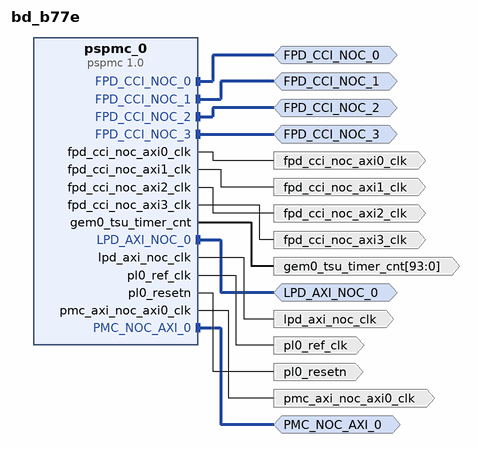
[diagram p0: block diagram of the top level]
# Vivado block design bd_b77e, xcvc1902-vsva2197-2MP-e-S, Vivado 2021.1
create_bd_design bd_b77e

create_bd_intf_port -mode Master -vlnv xilinx.com:interface:aximm_rtl:1.0 FPD_CCI_NOC_0
set_property -dict {CONFIG.FREQ_HZ 824999207 CONFIG.INDEX 0} [get_bd_intf_ports FPD_CCI_NOC_0]
create_bd_intf_port -mode Master -vlnv xilinx.com:interface:aximm_rtl:1.0 FPD_CCI_NOC_1
set_property -dict {CONFIG.FREQ_HZ 824999207 CONFIG.INDEX 1} [get_bd_intf_ports FPD_CCI_NOC_1]
create_bd_intf_port -mode Master -vlnv xilinx.com:interface:aximm_rtl:1.0 FPD_CCI_NOC_2
set_property -dict {CONFIG.FREQ_HZ 824999207 CONFIG.INDEX 2} [get_bd_intf_ports FPD_CCI_NOC_2]
create_bd_intf_port -mode Master -vlnv xilinx.com:interface:aximm_rtl:1.0 FPD_CCI_NOC_3
set_property -dict {CONFIG.FREQ_HZ 824999207 CONFIG.INDEX 3} [get_bd_intf_ports FPD_CCI_NOC_3]
create_bd_intf_port -mode Master -vlnv xilinx.com:interface:aximm_rtl:1.0 LPD_AXI_NOC_0
set_property -dict {CONFIG.FREQ_HZ 591666077 CONFIG.INDEX 0} [get_bd_intf_ports LPD_AXI_NOC_0]
create_bd_intf_port -mode Master -vlnv xilinx.com:interface:aximm_rtl:1.0 PMC_NOC_AXI_0
set_property -dict {CONFIG.FREQ_HZ 400000000 CONFIG.INDEX 0} [get_bd_intf_ports PMC_NOC_AXI_0]
create_bd_port -dir O -type clk pl0_ref_clk
set_property -dict {CONFIG.FREQ_HZ 333333008} [get_bd_ports pl0_ref_clk]
create_bd_port -dir O -type rst pl0_resetn
create_bd_port -dir O -type clk fpd_cci_noc_axi0_clk
set_property -dict {CONFIG.FREQ_HZ 824999207} [get_bd_ports fpd_cci_noc_axi0_clk]
create_bd_port -dir O -type clk fpd_cci_noc_axi1_clk
set_property -dict {CONFIG.FREQ_HZ 824999207} [get_bd_ports fpd_cci_noc_axi1_clk]
create_bd_port -dir O -type clk fpd_cci_noc_axi2_clk
set_property -dict {CONFIG.FREQ_HZ 824999207} [get_bd_ports fpd_cci_noc_axi2_clk]
create_bd_port -dir O -type clk fpd_cci_noc_axi3_clk
set_property -dict {CONFIG.FREQ_HZ 824999207} [get_bd_ports fpd_cci_noc_axi3_clk]
create_bd_port -dir O -type clk lpd_axi_noc_clk
set_property -dict {CONFIG.FREQ_HZ 591666077} [get_bd_ports lpd_axi_noc_clk]
create_bd_port -dir O -type clk pmc_axi_noc_axi0_clk
set_property -dict {CONFIG.FREQ_HZ 400000000} [get_bd_ports pmc_axi_noc_axi0_clk]
create_bd_port -dir O -from 93 -to 0 gem0_tsu_timer_cnt

create_bd_cell -type ip -vlnv xilinx.com:ip:pspmc:1.0 pspmc_0
set_property -dict [list \
  CONFIG.PMC_EXTERNAL_TAMPER {{{ENABLE 0} {IO None}}} \
  CONFIG.PMC_GPIO0_MIO_PERIPHERAL {{{ENABLE 1} {IO {PMC_MIO 0 .. 25}}}} \
  CONFIG.PMC_GPIO1_MIO_PERIPHERAL {{{ENABLE 1} {IO {PMC_MIO 26 .. 51}}}} \
  CONFIG.PMC_I2CPMC_PERIPHERAL {{{ENABLE 1} {IO {PMC_MIO 46 .. 47}}}} \
  CONFIG.PMC_MIO0 {{{AUX_IO 0} {DIRECTION out} {DRIVE_STRENGTH 8mA} {OUTPUT_DATA default} {PULL pullup} {SCHMITT 1} {SLEW slow} {USAGE Reserved}}} \
  CONFIG.PMC_MIO1 {{{AUX_IO 0} {DIRECTION inout} {DRIVE_STRENGTH 8mA} {OUTPUT_DATA default} {PULL pullup} {SCHMITT 0} {SLEW slow} {USAGE Reserved}}} \
  CONFIG.PMC_MIO2 {{{AUX_IO 0} {DIRECTION inout} {DRIVE_STRENGTH 8mA} {OUTPUT_DATA default} {PULL pullup} {SCHMITT 0} {SLEW slow} {USAGE Reserved}}} \
  CONFIG.PMC_MIO3 {{{AUX_IO 0} {DIRECTION inout} {DRIVE_STRENGTH 8mA} {OUTPUT_DATA default} {PULL pullup} {SCHMITT 0} {SLEW slow} {USAGE Reserved}}} \
  CONFIG.PMC_MIO4 {{{AUX_IO 0} {DIRECTION inout} {DRIVE_STRENGTH 8mA} {OUTPUT_DATA default} {PULL pullup} {SCHMITT 0} {SLEW slow} {USAGE Reserved}}} \
  CONFIG.PMC_MIO5 {{{AUX_IO 0} {DIRECTION out} {DRIVE_STRENGTH 8mA} {OUTPUT_DATA default} {PULL pullup} {SCHMITT 1} {SLEW slow} {USAGE Reserved}}} \
  CONFIG.PMC_MIO6 {{{AUX_IO 0} {DIRECTION out} {DRIVE_STRENGTH 8mA} {OUTPUT_DATA default} {PULL pullup} {SCHMITT 1} {SLEW slow} {USAGE Reserved}}} \
  CONFIG.PMC_MIO7 {{{AUX_IO 0} {DIRECTION out} {DRIVE_STRENGTH 8mA} {OUTPUT_DATA default} {PULL pullup} {SCHMITT 1} {SLEW slow} {USAGE Reserved}}} \
  CONFIG.PMC_MIO8 {{{AUX_IO 0} {DIRECTION inout} {DRIVE_STRENGTH 8mA} {OUTPUT_DATA default} {PULL pullup} {SCHMITT 0} {SLEW slow} {USAGE Reserved}}} \
  CONFIG.PMC_MIO9 {{{AUX_IO 0} {DIRECTION inout} {DRIVE_STRENGTH 8mA} {OUTPUT_DATA default} {PULL pullup} {SCHMITT 0} {SLEW slow} {USAGE Reserved}}} \
  CONFIG.PMC_MIO10 {{{AUX_IO 0} {DIRECTION inout} {DRIVE_STRENGTH 8mA} {OUTPUT_DATA default} {PULL pullup} {SCHMITT 0} {SLEW slow} {USAGE Reserved}}} \
  CONFIG.PMC_MIO11 {{{AUX_IO 0} {DIRECTION inout} {DRIVE_STRENGTH 8mA} {OUTPUT_DATA default} {PULL pullup} {SCHMITT 0} {SLEW slow} {USAGE Reserved}}} \
  CONFIG.PMC_MIO12 {{{AUX_IO 0} {DIRECTION out} {DRIVE_STRENGTH 8mA} {OUTPUT_DATA default} {PULL pullup} {SCHMITT 1} {SLEW slow} {USAGE Reserved}}} \
  CONFIG.PMC_MIO13 {{{AUX_IO 0} {DIRECTION out} {DRIVE_STRENGTH 8mA} {OUTPUT_DATA default} {PULL pullup} {SCHMITT 1} {SLEW slow} {USAGE Reserved}}} \
  CONFIG.PMC_MIO14 {{{AUX_IO 0} {DIRECTION inout} {DRIVE_STRENGTH 8mA} {OUTPUT_DATA default} {PULL pullup} {SCHMITT 0} {SLEW slow} {USAGE Reserved}}} \
  CONFIG.PMC_MIO15 {{{AUX_IO 0} {DIRECTION inout} {DRIVE_STRENGTH 8mA} {OUTPUT_DATA default} {PULL pullup} {SCHMITT 0} {SLEW slow} {USAGE Reserved}}} \
  CONFIG.PMC_MIO16 {{{AUX_IO 0} {DIRECTION inout} {DRIVE_STRENGTH 8mA} {OUTPUT_DATA default} {PULL pullup} {SCHMITT 0} {SLEW slow} {USAGE Reserved}}} \
  CONFIG.PMC_MIO17 {{{AUX_IO 0} {DIRECTION inout} {DRIVE_STRENGTH 8mA} {OUTPUT_DATA default} {PULL pullup} {SCHMITT 0} {SLEW slow} {USAGE Reserved}}} \
  CONFIG.PMC_MIO18 {{{AUX_IO 0} {DIRECTION in} {DRIVE_STRENGTH 8mA} {OUTPUT_DATA default} {PULL pullup} {SCHMITT 0} {SLEW slow} {USAGE Reserved}}} \
  CONFIG.PMC_MIO19 {{{AUX_IO 0} {DIRECTION inout} {DRIVE_STRENGTH 8mA} {OUTPUT_DATA default} {PULL pullup} {SCHMITT 0} {SLEW slow} {USAGE Reserved}}} \
  CONFIG.PMC_MIO20 {{{AUX_IO 0} {DIRECTION inout} {DRIVE_STRENGTH 8mA} {OUTPUT_DATA default} {PULL pullup} {SCHMITT 0} {SLEW slow} {USAGE Reserved}}} \
  CONFIG.PMC_MIO21 {{{AUX_IO 0} {DIRECTION inout} {DRIVE_STRENGTH 8mA} {OUTPUT_DATA default} {PULL pullup} {SCHMITT 0} {SLEW slow} {USAGE Reserved}}} \
  CONFIG.PMC_MIO22 {{{AUX_IO 0} {DIRECTION inout} {DRIVE_STRENGTH 8mA} {OUTPUT_DATA default} {PULL pullup} {SCHMITT 0} {SLEW slow} {USAGE Reserved}}} \
  CONFIG.PMC_MIO23 {{{AUX_IO 0} {DIRECTION in} {DRIVE_STRENGTH 8mA} {OUTPUT_DATA default} {PULL pullup} {SCHMITT 0} {SLEW slow} {USAGE Reserved}}} \
  CONFIG.PMC_MIO24 {{{AUX_IO 0} {DIRECTION out} {DRIVE_STRENGTH 8mA} {OUTPUT_DATA default} {PULL pullup} {SCHMITT 1} {SLEW slow} {USAGE Reserved}}} \
  CONFIG.PMC_MIO25 {{{AUX_IO 0} {DIRECTION in} {DRIVE_STRENGTH 8mA} {OUTPUT_DATA default} {PULL pullup} {SCHMITT 0} {SLEW slow} {USAGE Reserved}}} \
  CONFIG.PMC_MIO26 {{{AUX_IO 0} {DIRECTION inout} {DRIVE_STRENGTH 8mA} {OUTPUT_DATA default} {PULL pullup} {SCHMITT 0} {SLEW slow} {USAGE Reserved}}} \
  CONFIG.PMC_MIO27 {{{AUX_IO 0} {DIRECTION inout} {DRIVE_STRENGTH 8mA} {OUTPUT_DATA default} {PULL pullup} {SCHMITT 0} {SLEW slow} {USAGE Reserved}}} \
  CONFIG.PMC_MIO28 {{{AUX_IO 0} {DIRECTION in} {DRIVE_STRENGTH 8mA} {OUTPUT_DATA default} {PULL pullup} {SCHMITT 0} {SLEW slow} {USAGE Reserved}}} \
  CONFIG.PMC_MIO29 {{{AUX_IO 0} {DIRECTION inout} {DRIVE_STRENGTH 8mA} {OUTPUT_DATA default} {PULL pullup} {SCHMITT 0} {SLEW slow} {USAGE Reserved}}} \
  CONFIG.PMC_MIO30 {{{AUX_IO 0} {DIRECTION inout} {DRIVE_STRENGTH 8mA} {OUTPUT_DATA default} {PULL pullup} {SCHMITT 0} {SLEW slow} {USAGE Reserved}}} \
  CONFIG.PMC_MIO31 {{{AUX_IO 0} {DIRECTION inout} {DRIVE_STRENGTH 8mA} {OUTPUT_DATA default} {PULL pullup} {SCHMITT 0} {SLEW slow} {USAGE Reserved}}} \
  CONFIG.PMC_MIO32 {{{AUX_IO 0} {DIRECTION inout} {DRIVE_STRENGTH 8mA} {OUTPUT_DATA default} {PULL pullup} {SCHMITT 0} {SLEW slow} {USAGE Reserved}}} \
  CONFIG.PMC_MIO33 {{{AUX_IO 0} {DIRECTION inout} {DRIVE_STRENGTH 8mA} {OUTPUT_DATA default} {PULL pullup} {SCHMITT 0} {SLEW slow} {USAGE Reserved}}} \
  CONFIG.PMC_MIO34 {{{AUX_IO 0} {DIRECTION inout} {DRIVE_STRENGTH 8mA} {OUTPUT_DATA default} {PULL pullup} {SCHMITT 0} {SLEW slow} {USAGE Reserved}}} \
  CONFIG.PMC_MIO35 {{{AUX_IO 0} {DIRECTION inout} {DRIVE_STRENGTH 8mA} {OUTPUT_DATA default} {PULL pullup} {SCHMITT 0} {SLEW slow} {USAGE Reserved}}} \
  CONFIG.PMC_MIO36 {{{AUX_IO 0} {DIRECTION inout} {DRIVE_STRENGTH 8mA} {OUTPUT_DATA default} {PULL pullup} {SCHMITT 0} {SLEW slow} {USAGE Reserved}}} \
  CONFIG.PMC_MIO37 {{{AUX_IO 0} {DIRECTION out} {DRIVE_STRENGTH 8mA} {OUTPUT_DATA high} {PULL pullup} {SCHMITT 0} {SLEW slow} {USAGE GPIO}}} \
  CONFIG.PMC_MIO38 {{{AUX_IO 0} {DIRECTION in} {DRIVE_STRENGTH 8mA} {OUTPUT_DATA default} {PULL pullup} {SCHMITT 0} {SLEW slow} {USAGE Unassigned}}} \
  CONFIG.PMC_MIO39 {{{AUX_IO 0} {DIRECTION in} {DRIVE_STRENGTH 8mA} {OUTPUT_DATA default} {PULL pullup} {SCHMITT 0} {SLEW slow} {USAGE Unassigned}}} \
  CONFIG.PMC_MIO40 {{{AUX_IO 0} {DIRECTION out} {DRIVE_STRENGTH 8mA} {OUTPUT_DATA default} {PULL pullup} {SCHMITT 1} {SLEW slow} {USAGE Reserved}}} \
  CONFIG.PMC_MIO41 {{{AUX_IO 0} {DIRECTION in} {DRIVE_STRENGTH 8mA} {OUTPUT_DATA default} {PULL pullup} {SCHMITT 0} {SLEW slow} {USAGE Reserved}}} \
  CONFIG.PMC_MIO42 {{{AUX_IO 0} {DIRECTION in} {DRIVE_STRENGTH 8mA} {OUTPUT_DATA default} {PULL pullup} {SCHMITT 0} {SLEW slow} {USAGE Reserved}}} \
  CONFIG.PMC_MIO43 {{{AUX_IO 0} {DIRECTION out} {DRIVE_STRENGTH 8mA} {OUTPUT_DATA default} {PULL pullup} {SCHMITT 1} {SLEW slow} {USAGE Reserved}}} \
  CONFIG.PMC_MIO44 {{{AUX_IO 0} {DIRECTION inout} {DRIVE_STRENGTH 8mA} {OUTPUT_DATA default} {PULL pullup} {SCHMITT 0} {SLEW slow} {USAGE Reserved}}} \
  CONFIG.PMC_MIO45 {{{AUX_IO 0} {DIRECTION inout} {DRIVE_STRENGTH 8mA} {OUTPUT_DATA default} {PULL pullup} {SCHMITT 0} {SLEW slow} {USAGE Reserved}}} \
  CONFIG.PMC_MIO46 {{{AUX_IO 0} {DIRECTION inout} {DRIVE_STRENGTH 8mA} {OUTPUT_DATA default} {PULL pullup} {SCHMITT 0} {SLEW slow} {USAGE Reserved}}} \
  CONFIG.PMC_MIO47 {{{AUX_IO 0} {DIRECTION inout} {DRIVE_STRENGTH 8mA} {OUTPUT_DATA default} {PULL pullup} {SCHMITT 0} {SLEW slow} {USAGE Reserved}}} \
  CONFIG.PMC_MIO48 {{{AUX_IO 0} {DIRECTION in} {DRIVE_STRENGTH 8mA} {OUTPUT_DATA default} {PULL pullup} {SCHMITT 0} {SLEW slow} {USAGE Unassigned}}} \
  CONFIG.PMC_MIO49 {{{AUX_IO 0} {DIRECTION in} {DRIVE_STRENGTH 8mA} {OUTPUT_DATA default} {PULL pullup} {SCHMITT 0} {SLEW slow} {USAGE Unassigned}}} \
  CONFIG.PMC_MIO50 {{{AUX_IO 0} {DIRECTION in} {DRIVE_STRENGTH 8mA} {OUTPUT_DATA default} {PULL pullup} {SCHMITT 0} {SLEW slow} {USAGE Unassigned}}} \
  CONFIG.PMC_MIO51 {{{AUX_IO 0} {DIRECTION out} {DRIVE_STRENGTH 8mA} {OUTPUT_DATA default} {PULL pullup} {SCHMITT 1} {SLEW slow} {USAGE Reserved}}} \
  CONFIG.PMC_OSPI_PERIPHERAL {{{ENABLE 0} {IO {PMC_MIO 0 .. 11}} {MODE Single}}} \
  CONFIG.PMC_QSPI_FBCLK {{{ENABLE 1} {IO {PMC_MIO 6}}}} \
  CONFIG.PMC_SD0 {{{CD_ENABLE 0} {CD_IO {PMC_MIO 24}} {POW_ENABLE 0} {POW_IO {PMC_MIO 17}} {RESET_ENABLE 0} {RESET_IO {PMC_MIO 17}} {WP_ENABLE 0} {WP_IO {PMC_MIO 25}}}} \
  CONFIG.PMC_SD0_PERIPHERAL {{{ENABLE 0} {IO {PMC_MIO 13 .. 25}}}} \
  CONFIG.PMC_SD1 {{{CD_ENABLE 1} {CD_IO {PMC_MIO 28}} {POW_ENABLE 1} {POW_IO {PMC_MIO 51}} {RESET_ENABLE 0} {RESET_IO {PMC_MIO 1}} {WP_ENABLE 0} {WP_IO {PMC_MIO 1}}}} \
  CONFIG.PMC_SD1_PERIPHERAL {{{ENABLE 1} {IO {PMC_MIO 26 .. 36}}}} \
  CONFIG.PMC_SMAP_PERIPHERAL {{{ENABLE 0} {IO {32 Bit}}}} \
  CONFIG.PMC_WDT_PERIPHERAL {{{ENABLE 0} {IO {PMC_MIO 0}}}} \
  CONFIG.PS_BOARD_INTERFACE ps_pmc_fixed_io \
  CONFIG.PS_CAN0_CLK {{{ENABLE 0} {IO {PMC_MIO 0}}}} \
  CONFIG.PS_CAN0_PERIPHERAL {{{ENABLE 0} {IO {PMC_MIO 8 .. 9}}}} \
  CONFIG.PS_CAN1_CLK {{{ENABLE 0} {IO {PMC_MIO 0}}}} \
  CONFIG.PS_CAN1_PERIPHERAL {{{ENABLE 1} {IO {PMC_MIO 40 .. 41}}}} \
  CONFIG.PS_ENET0_MDIO {{{ENABLE 1} {IO {PS_MIO 24 .. 25}}}} \
  CONFIG.PS_ENET0_PERIPHERAL {{{ENABLE 1} {IO {PS_MIO 0 .. 11}}}} \
  CONFIG.PS_ENET1_MDIO {{{ENABLE 0} {IO {PMC_MIO 50 .. 51}}}} \
  CONFIG.PS_ENET1_PERIPHERAL {{{ENABLE 1} {IO {PS_MIO 12 .. 23}}}} \
  CONFIG.PS_GEM_TSU {{{ENABLE 0} {IO {PS_MIO 24}}}} \
  CONFIG.PS_GPIO2_MIO_PERIPHERAL {{{ENABLE 0} {IO {PS_MIO 0 .. 25}}}} \
  CONFIG.PS_I2C0_PERIPHERAL {{{ENABLE 0} {IO {PS_MIO 2 .. 3}}}} \
  CONFIG.PS_I2C1_PERIPHERAL {{{ENABLE 1} {IO {PMC_MIO 44 .. 45}}}} \
  CONFIG.PS_I2CSYSMON_PERIPHERAL {{{ENABLE 0} {IO {PS_MIO 23 .. 25}}}} \
  CONFIG.PS_IRQ_USAGE {{{CH0 0} {CH1 0} {CH10 0} {CH11 0} {CH12 0} {CH13 0} {CH14 0} {CH15 0} {CH2 0} {CH3 0} {CH4 0} {CH5 0} {CH6 0} {CH7 0} {CH8 0} {CH9 0}}} \
  CONFIG.PS_LPD_DMA_CHANNEL_ENABLE {{{CH0 0} {CH1 0} {CH2 0} {CH3 0} {CH4 0} {CH5 0} {CH6 0} {CH7 0}}} \
  CONFIG.PS_LPD_DMA_CH_TZ {{{CH0 NonSecure} {CH1 NonSecure} {CH2 NonSecure} {CH3 NonSecure} {CH4 NonSecure} {CH5 NonSecure} {CH6 NonSecure} {CH7 NonSecure}}} \
  CONFIG.PS_MIO0 {{{AUX_IO 0} {DIRECTION out} {DRIVE_STRENGTH 8mA} {OUTPUT_DATA default} {PULL pullup} {SCHMITT 1} {SLEW slow} {USAGE Reserved}}} \
  CONFIG.PS_MIO1 {{{AUX_IO 0} {DIRECTION out} {DRIVE_STRENGTH 8mA} {OUTPUT_DATA default} {PULL pullup} {SCHMITT 1} {SLEW slow} {USAGE Reserved}}} \
  CONFIG.PS_MIO2 {{{AUX_IO 0} {DIRECTION out} {DRIVE_STRENGTH 8mA} {OUTPUT_DATA default} {PULL pullup} {SCHMITT 1} {SLEW slow} {USAGE Reserved}}} \
  CONFIG.PS_MIO3 {{{AUX_IO 0} {DIRECTION out} {DRIVE_STRENGTH 8mA} {OUTPUT_DATA default} {PULL pullup} {SCHMITT 1} {SLEW slow} {USAGE Reserved}}} \
  CONFIG.PS_MIO4 {{{AUX_IO 0} {DIRECTION out} {DRIVE_STRENGTH 8mA} {OUTPUT_DATA default} {PULL pullup} {SCHMITT 1} {SLEW slow} {USAGE Reserved}}} \
  CONFIG.PS_MIO5 {{{AUX_IO 0} {DIRECTION out} {DRIVE_STRENGTH 8mA} {OUTPUT_DATA default} {PULL pullup} {SCHMITT 1} {SLEW slow} {USAGE Reserved}}} \
  CONFIG.PS_MIO6 {{{AUX_IO 0} {DIRECTION in} {DRIVE_STRENGTH 8mA} {OUTPUT_DATA default} {PULL pullup} {SCHMITT 0} {SLEW slow} {USAGE Reserved}}} \
  CONFIG.PS_MIO7 {{{AUX_IO 0} {DIRECTION in} {DRIVE_STRENGTH 8mA} {OUTPUT_DATA default} {PULL disable} {SCHMITT 0} {SLEW slow} {USAGE Reserved}}} \
  CONFIG.PS_MIO8 {{{AUX_IO 0} {DIRECTION in} {DRIVE_STRENGTH 8mA} {OUTPUT_DATA default} {PULL pullup} {SCHMITT 0} {SLEW slow} {USAGE Reserved}}} \
  CONFIG.PS_MIO9 {{{AUX_IO 0} {DIRECTION in} {DRIVE_STRENGTH 8mA} {OUTPUT_DATA default} {PULL disable} {SCHMITT 0} {SLEW slow} {USAGE Reserved}}} \
  CONFIG.PS_MIO10 {{{AUX_IO 0} {DIRECTION in} {DRIVE_STRENGTH 8mA} {OUTPUT_DATA default} {PULL pullup} {SCHMITT 0} {SLEW slow} {USAGE Reserved}}} \
  CONFIG.PS_MIO11 {{{AUX_IO 0} {DIRECTION in} {DRIVE_STRENGTH 8mA} {OUTPUT_DATA default} {PULL pullup} {SCHMITT 0} {SLEW slow} {USAGE Reserved}}} \
  CONFIG.PS_MIO12 {{{AUX_IO 0} {DIRECTION out} {DRIVE_STRENGTH 8mA} {OUTPUT_DATA default} {PULL pullup} {SCHMITT 1} {SLEW slow} {USAGE Reserved}}} \
  CONFIG.PS_MIO13 {{{AUX_IO 0} {DIRECTION out} {DRIVE_STRENGTH 8mA} {OUTPUT_DATA default} {PULL pullup} {SCHMITT 1} {SLEW slow} {USAGE Reserved}}} \
  CONFIG.PS_MIO14 {{{AUX_IO 0} {DIRECTION out} {DRIVE_STRENGTH 8mA} {OUTPUT_DATA default} {PULL pullup} {SCHMITT 1} {SLEW slow} {USAGE Reserved}}} \
  CONFIG.PS_MIO15 {{{AUX_IO 0} {DIRECTION out} {DRIVE_STRENGTH 8mA} {OUTPUT_DATA default} {PULL pullup} {SCHMITT 1} {SLEW slow} {USAGE Reserved}}} \
  CONFIG.PS_MIO16 {{{AUX_IO 0} {DIRECTION out} {DRIVE_STRENGTH 8mA} {OUTPUT_DATA default} {PULL pullup} {SCHMITT 1} {SLEW slow} {USAGE Reserved}}} \
  CONFIG.PS_MIO17 {{{AUX_IO 0} {DIRECTION out} {DRIVE_STRENGTH 8mA} {OUTPUT_DATA default} {PULL pullup} {SCHMITT 1} {SLEW slow} {USAGE Reserved}}} \
  CONFIG.PS_MIO18 {{{AUX_IO 0} {DIRECTION in} {DRIVE_STRENGTH 8mA} {OUTPUT_DATA default} {PULL pullup} {SCHMITT 0} {SLEW slow} {USAGE Reserved}}} \
  CONFIG.PS_MIO19 {{{AUX_IO 0} {DIRECTION in} {DRIVE_STRENGTH 8mA} {OUTPUT_DATA default} {PULL disable} {SCHMITT 0} {SLEW slow} {USAGE Reserved}}} \
  CONFIG.PS_MIO20 {{{AUX_IO 0} {DIRECTION in} {DRIVE_STRENGTH 8mA} {OUTPUT_DATA default} {PULL pullup} {SCHMITT 0} {SLEW slow} {USAGE Reserved}}} \
  CONFIG.PS_MIO21 {{{AUX_IO 0} {DIRECTION in} {DRIVE_STRENGTH 8mA} {OUTPUT_DATA default} {PULL disable} {SCHMITT 0} {SLEW slow} {USAGE Reserved}}} \
  CONFIG.PS_MIO22 {{{AUX_IO 0} {DIRECTION in} {DRIVE_STRENGTH 8mA} {OUTPUT_DATA default} {PULL pullup} {SCHMITT 0} {SLEW slow} {USAGE Reserved}}} \
  CONFIG.PS_MIO23 {{{AUX_IO 0} {DIRECTION in} {DRIVE_STRENGTH 8mA} {OUTPUT_DATA default} {PULL pullup} {SCHMITT 0} {SLEW slow} {USAGE Reserved}}} \
  CONFIG.PS_MIO24 {{{AUX_IO 0} {DIRECTION out} {DRIVE_STRENGTH 8mA} {OUTPUT_DATA default} {PULL pullup} {SCHMITT 1} {SLEW slow} {USAGE Reserved}}} \
  CONFIG.PS_MIO25 {{{AUX_IO 0} {DIRECTION inout} {DRIVE_STRENGTH 8mA} {OUTPUT_DATA default} {PULL pullup} {SCHMITT 0} {SLEW slow} {USAGE Reserved}}} \
  CONFIG.PS_PCIE_RESET {{{ENABLE 1} {IO {PMC_MIO 38 .. 39}}}} \
  CONFIG.PS_PMCPL_CLK0_BUF 1 \
  CONFIG.PS_SPI0 {{{GRP_SS0_ENABLE 0} {GRP_SS0_IO {PMC_MIO 15}} {GRP_SS1_ENABLE 0} {GRP_SS1_IO {PMC_MIO 14}} {GRP_SS2_ENABLE 0} {GRP_SS2_IO {PMC_MIO 13}} {PERIPHERAL_ENABLE 0} {PERIPHERAL_IO {PMC_MIO 12 .. 17}}}} \
  CONFIG.PS_SPI1 {{{GRP_SS0_ENABLE 0} {GRP_SS0_IO {PS_MIO 9}} {GRP_SS1_ENABLE 0} {GRP_SS1_IO {PS_MIO 8}} {GRP_SS2_ENABLE 0} {GRP_SS2_IO {PS_MIO 7}} {PERIPHERAL_ENABLE 0} {PERIPHERAL_IO {PS_MIO 6 .. 11}}}} \
  CONFIG.PS_TRACE_PERIPHERAL {{{ENABLE 0} {IO {PMC_MIO 30 .. 47}}}} \
  CONFIG.PS_TTC0_CLK {{{ENABLE 0} {IO {PS_MIO 6}}}} \
  CONFIG.PS_TTC0_WAVEOUT {{{ENABLE 0} {IO {PS_MIO 7}}}} \
  CONFIG.PS_TTC1_CLK {{{ENABLE 0} {IO {PS_MIO 12}}}} \
  CONFIG.PS_TTC1_WAVEOUT {{{ENABLE 0} {IO {PS_MIO 13}}}} \
  CONFIG.PS_TTC2_CLK {{{ENABLE 0} {IO {PS_MIO 2}}}} \
  CONFIG.PS_TTC2_WAVEOUT {{{ENABLE 0} {IO {PS_MIO 3}}}} \
  CONFIG.PS_TTC3_CLK {{{ENABLE 0} {IO {PS_MIO 16}}}} \
  CONFIG.PS_TTC3_WAVEOUT {{{ENABLE 0} {IO {PS_MIO 17}}}} \
  CONFIG.PS_UART0_PERIPHERAL {{{ENABLE 1} {IO {PMC_MIO 42 .. 43}}}} \
  CONFIG.PS_UART0_RTS_CTS {{{ENABLE 0} {IO {PS_MIO 2 .. 3}}}} \
  CONFIG.PS_UART1_PERIPHERAL {{{ENABLE 0} {IO {PMC_MIO 4 .. 5}}}} \
  CONFIG.PS_UART1_RTS_CTS {{{ENABLE 0} {IO {PMC_MIO 6 .. 7}}}} \
  CONFIG.PS_USB3_PERIPHERAL {{{ENABLE 1} {IO {PMC_MIO 13 .. 25}}}} \
  CONFIG.PS_WWDT0_CLK {{{ENABLE 0} {IO {PMC_MIO 0}}}} \
  CONFIG.PS_WWDT0_PERIPHERAL {{{ENABLE 0} {IO {PMC_MIO 0 .. 5}}}} \
  CONFIG.PS_WWDT1_CLK {{{ENABLE 0} {IO {PMC_MIO 6}}}} \
  CONFIG.PS_WWDT1_PERIPHERAL {{{ENABLE 0} {IO {PMC_MIO 6 .. 11}}}} \
  CONFIG.SMON_MEAS0 {{{ALARM_ENABLE 0} {ALARM_LOWER 0.00} {ALARM_UPPER 2.00} {AVERAGE_EN 0} {ENABLE 0} {MODE {2 V unipolar}} {NAME GTY_AVCCAUX_103}}} \
  CONFIG.SMON_MEAS1 {{{ALARM_ENABLE 0} {ALARM_LOWER 0.00} {ALARM_UPPER 2.00} {AVERAGE_EN 0} {ENABLE 0} {MODE {2 V unipolar}} {NAME GTY_AVCCAUX_104}}} \
  CONFIG.SMON_MEAS2 {{{ALARM_ENABLE 0} {ALARM_LOWER 0.00} {ALARM_UPPER 2.00} {AVERAGE_EN 0} {ENABLE 0} {MODE {2 V unipolar}} {NAME GTY_AVCCAUX_105}}} \
  CONFIG.SMON_MEAS3 {{{ALARM_ENABLE 0} {ALARM_LOWER 0.00} {ALARM_UPPER 2.00} {AVERAGE_EN 0} {ENABLE 0} {MODE {2 V unipolar}} {NAME GTY_AVCCAUX_106}}} \
  CONFIG.SMON_MEAS4 {{{ALARM_ENABLE 0} {ALARM_LOWER 0.00} {ALARM_UPPER 2.00} {AVERAGE_EN 0} {ENABLE 0} {MODE {2 V unipolar}} {NAME GTY_AVCCAUX_200}}} \
  CONFIG.SMON_MEAS5 {{{ALARM_ENABLE 0} {ALARM_LOWER 0.00} {ALARM_UPPER 2.00} {AVERAGE_EN 0} {ENABLE 0} {MODE {2 V unipolar}} {NAME GTY_AVCCAUX_201}}} \
  CONFIG.SMON_MEAS6 {{{ALARM_ENABLE 0} {ALARM_LOWER 0.00} {ALARM_UPPER 2.00} {AVERAGE_EN 0} {ENABLE 0} {MODE {2 V unipolar}} {NAME GTY_AVCCAUX_202}}} \
  CONFIG.SMON_MEAS7 {{{ALARM_ENABLE 0} {ALARM_LOWER 0.00} {ALARM_UPPER 2.00} {AVERAGE_EN 0} {ENABLE 0} {MODE {2 V unipolar}} {NAME GTY_AVCCAUX_203}}} \
  CONFIG.SMON_MEAS8 {{{ALARM_ENABLE 0} {ALARM_LOWER 0.00} {ALARM_UPPER 2.00} {AVERAGE_EN 0} {ENABLE 0} {MODE {2 V unipolar}} {NAME GTY_AVCCAUX_204}}} \
  CONFIG.SMON_MEAS9 {{{ALARM_ENABLE 0} {ALARM_LOWER 0.00} {ALARM_UPPER 2.00} {AVERAGE_EN 0} {ENABLE 0} {MODE {2 V unipolar}} {NAME GTY_AVCCAUX_205}}} \
  CONFIG.SMON_MEAS10 {{{ALARM_ENABLE 0} {ALARM_LOWER 0.00} {ALARM_UPPER 2.00} {AVERAGE_EN 0} {ENABLE 0} {MODE {2 V unipolar}} {NAME GTY_AVCCAUX_206}}} \
  CONFIG.SMON_MEAS11 {{{ALARM_ENABLE 0} {ALARM_LOWER 0.00} {ALARM_UPPER 2.00} {AVERAGE_EN 0} {ENABLE 0} {MODE {2 V unipolar}} {NAME GTY_AVCC_103}}} \
  CONFIG.SMON_MEAS12 {{{ALARM_ENABLE 0} {ALARM_LOWER 0.00} {ALARM_UPPER 2.00} {AVERAGE_EN 0} {ENABLE 0} {MODE {2 V unipolar}} {NAME GTY_AVCC_104}}} \
  CONFIG.SMON_MEAS13 {{{ALARM_ENABLE 0} {ALARM_LOWER 0.00} {ALARM_UPPER 2.00} {AVERAGE_EN 0} {ENABLE 0} {MODE {2 V unipolar}} {NAME GTY_AVCC_105}}} \
  CONFIG.SMON_MEAS14 {{{ALARM_ENABLE 0} {ALARM_LOWER 0.00} {ALARM_UPPER 2.00} {AVERAGE_EN 0} {ENABLE 0} {MODE {2 V unipolar}} {NAME GTY_AVCC_106}}} \
  CONFIG.SMON_MEAS15 {{{ALARM_ENABLE 0} {ALARM_LOWER 0.00} {ALARM_UPPER 2.00} {AVERAGE_EN 0} {ENABLE 0} {MODE {2 V unipolar}} {NAME GTY_AVCC_200}}} \
  CONFIG.SMON_MEAS16 {{{ALARM_ENABLE 0} {ALARM_LOWER 0.00} {ALARM_UPPER 2.00} {AVERAGE_EN 0} {ENABLE 0} {MODE {2 V unipolar}} {NAME GTY_AVCC_201}}} \
  CONFIG.SMON_MEAS17 {{{ALARM_ENABLE 0} {ALARM_LOWER 0.00} {ALARM_UPPER 2.00} {AVERAGE_EN 0} {ENABLE 0} {MODE {2 V unipolar}} {NAME GTY_AVCC_202}}} \
  CONFIG.SMON_MEAS18 {{{ALARM_ENABLE 0} {ALARM_LOWER 0.00} {ALARM_UPPER 2.00} {AVERAGE_EN 0} {ENABLE 0} {MODE {2 V unipolar}} {NAME GTY_AVCC_203}}} \
  CONFIG.SMON_MEAS19 {{{ALARM_ENABLE 0} {ALARM_LOWER 0.00} {ALARM_UPPER 2.00} {AVERAGE_EN 0} {ENABLE 0} {MODE {2 V unipolar}} {NAME GTY_AVCC_204}}} \
  CONFIG.SMON_MEAS20 {{{ALARM_ENABLE 0} {ALARM_LOWER 0.00} {ALARM_UPPER 2.00} {AVERAGE_EN 0} {ENABLE 0} {MODE {2 V unipolar}} {NAME GTY_AVCC_205}}} \
  CONFIG.SMON_MEAS21 {{{ALARM_ENABLE 0} {ALARM_LOWER 0.00} {ALARM_UPPER 2.00} {AVERAGE_EN 0} {ENABLE 0} {MODE {2 V unipolar}} {NAME GTY_AVCC_206}}} \
  CONFIG.SMON_MEAS22 {{{ALARM_ENABLE 0} {ALARM_LOWER 0.00} {ALARM_UPPER 2.00} {AVERAGE_EN 0} {ENABLE 0} {MODE {2 V unipolar}} {NAME GTY_AVTT_103}}} \
  CONFIG.SMON_MEAS23 {{{ALARM_ENABLE 0} {ALARM_LOWER 0.00} {ALARM_UPPER 2.00} {AVERAGE_EN 0} {ENABLE 0} {MODE {2 V unipolar}} {NAME GTY_AVTT_104}}} \
  CONFIG.SMON_MEAS24 {{{ALARM_ENABLE 0} {ALARM_LOWER 0.00} {ALARM_UPPER 2.00} {AVERAGE_EN 0} {ENABLE 0} {MODE {2 V unipolar}} {NAME GTY_AVTT_105}}} \
  CONFIG.SMON_MEAS25 {{{ALARM_ENABLE 0} {ALARM_LOWER 0.00} {ALARM_UPPER 2.00} {AVERAGE_EN 0} {ENABLE 0} {MODE {2 V unipolar}} {NAME GTY_AVTT_106}}} \
  CONFIG.SMON_MEAS26 {{{ALARM_ENABLE 0} {ALARM_LOWER 0.00} {ALARM_UPPER 2.00} {AVERAGE_EN 0} {ENABLE 0} {MODE {2 V unipolar}} {NAME GTY_AVTT_200}}} \
  CONFIG.SMON_MEAS27 {{{ALARM_ENABLE 0} {ALARM_LOWER 0.00} {ALARM_UPPER 2.00} {AVERAGE_EN 0} {ENABLE 0} {MODE {2 V unipolar}} {NAME GTY_AVTT_201}}} \
  CONFIG.SMON_MEAS28 {{{ALARM_ENABLE 0} {ALARM_LOWER 0.00} {ALARM_UPPER 2.00} {AVERAGE_EN 0} {ENABLE 0} {MODE {2 V unipolar}} {NAME GTY_AVTT_202}}} \
  CONFIG.SMON_MEAS29 {{{ALARM_ENABLE 0} {ALARM_LOWER 0.00} {ALARM_UPPER 2.00} {AVERAGE_EN 0} {ENABLE 0} {MODE {2 V unipolar}} {NAME GTY_AVTT_203}}} \
  CONFIG.SMON_MEAS30 {{{ALARM_ENABLE 0} {ALARM_LOWER 0.00} {ALARM_UPPER 2.00} {AVERAGE_EN 0} {ENABLE 0} {MODE {2 V unipolar}} {NAME GTY_AVTT_204}}} \
  CONFIG.SMON_MEAS31 {{{ALARM_ENABLE 0} {ALARM_LOWER 0.00} {ALARM_UPPER 2.00} {AVERAGE_EN 0} {ENABLE 0} {MODE {2 V unipolar}} {NAME GTY_AVTT_205}}} \
  CONFIG.SMON_MEAS32 {{{ALARM_ENABLE 0} {ALARM_LOWER 0.00} {ALARM_UPPER 2.00} {AVERAGE_EN 0} {ENABLE 0} {MODE {2 V unipolar}} {NAME GTY_AVTT_206}}} \
  CONFIG.SMON_MEAS33 {{{ALARM_ENABLE 0} {ALARM_LOWER 0.00} {ALARM_UPPER 2.00} {AVERAGE_EN 0} {ENABLE 0} {MODE {2 V unipolar}} {NAME VCCAUX}}} \
  CONFIG.SMON_MEAS34 {{{ALARM_ENABLE 0} {ALARM_LOWER 0.00} {ALARM_UPPER 2.00} {AVERAGE_EN 0} {ENABLE 0} {MODE {2 V unipolar}} {NAME VCCAUX_PMC}}} \
  CONFIG.SMON_MEAS35 {{{ALARM_ENABLE 0} {ALARM_LOWER 0.00} {ALARM_UPPER 2.00} {AVERAGE_EN 0} {ENABLE 0} {MODE {2 V unipolar}} {NAME VCCAUX_SMON}}} \
  CONFIG.SMON_MEAS36 {{{ALARM_ENABLE 0} {ALARM_LOWER 0.00} {ALARM_UPPER 2.00} {AVERAGE_EN 0} {ENABLE 0} {MODE {2 V unipolar}} {NAME VCCINT}}} \
  CONFIG.SMON_MEAS37 {{{ALARM_ENABLE 0} {ALARM_LOWER 0.00} {ALARM_UPPER 2.00} {AVERAGE_EN 0} {ENABLE 0} {MODE {4 V unipolar}} {NAME VCCO_306}}} \
  CONFIG.SMON_MEAS38 {{{ALARM_ENABLE 0} {ALARM_LOWER 0.00} {ALARM_UPPER 2.00} {AVERAGE_EN 0} {ENABLE 0} {MODE {4 V unipolar}} {NAME VCCO_406}}} \
  CONFIG.SMON_MEAS39 {{{ALARM_ENABLE 0} {ALARM_LOWER 0.00} {ALARM_UPPER 2.00} {AVERAGE_EN 0} {ENABLE 0} {MODE {4 V unipolar}} {NAME VCCO_500}}} \
  CONFIG.SMON_MEAS40 {{{ALARM_ENABLE 0} {ALARM_LOWER 0.00} {ALARM_UPPER 2.00} {AVERAGE_EN 0} {ENABLE 0} {MODE {4 V unipolar}} {NAME VCCO_501}}} \
  CONFIG.SMON_MEAS41 {{{ALARM_ENABLE 0} {ALARM_LOWER 0.00} {ALARM_UPPER 2.00} {AVERAGE_EN 0} {ENABLE 0} {MODE {4 V unipolar}} {NAME VCCO_502}}} \
  CONFIG.SMON_MEAS42 {{{ALARM_ENABLE 0} {ALARM_LOWER 0.00} {ALARM_UPPER 2.00} {AVERAGE_EN 0} {ENABLE 0} {MODE {4 V unipolar}} {NAME VCCO_503}}} \
  CONFIG.SMON_MEAS43 {{{ALARM_ENABLE 0} {ALARM_LOWER 0.00} {ALARM_UPPER 2.00} {AVERAGE_EN 0} {ENABLE 0} {MODE {2 V unipolar}} {NAME VCCO_700}}} \
  CONFIG.SMON_MEAS44 {{{ALARM_ENABLE 0} {ALARM_LOWER 0.00} {ALARM_UPPER 2.00} {AVERAGE_EN 0} {ENABLE 0} {MODE {2 V unipolar}} {NAME VCCO_701}}} \
  CONFIG.SMON_MEAS45 {{{ALARM_ENABLE 0} {ALARM_LOWER 0.00} {ALARM_UPPER 2.00} {AVERAGE_EN 0} {ENABLE 0} {MODE {2 V unipolar}} {NAME VCCO_702}}} \
  CONFIG.SMON_MEAS46 {{{ALARM_ENABLE 0} {ALARM_LOWER 0.00} {ALARM_UPPER 2.00} {AVERAGE_EN 0} {ENABLE 0} {MODE {2 V unipolar}} {NAME VCCO_703}}} \
  CONFIG.SMON_MEAS47 {{{ALARM_ENABLE 0} {ALARM_LOWER 0.00} {ALARM_UPPER 2.00} {AVERAGE_EN 0} {ENABLE 0} {MODE {2 V unipolar}} {NAME VCCO_704}}} \
  CONFIG.SMON_MEAS48 {{{ALARM_ENABLE 0} {ALARM_LOWER 0.00} {ALARM_UPPER 2.00} {AVERAGE_EN 0} {ENABLE 0} {MODE {2 V unipolar}} {NAME VCCO_705}}} \
  CONFIG.SMON_MEAS49 {{{ALARM_ENABLE 0} {ALARM_LOWER 0.00} {ALARM_UPPER 2.00} {AVERAGE_EN 0} {ENABLE 0} {MODE {2 V unipolar}} {NAME VCCO_706}}} \
  CONFIG.SMON_MEAS50 {{{ALARM_ENABLE 0} {ALARM_LOWER 0.00} {ALARM_UPPER 2.00} {AVERAGE_EN 0} {ENABLE 0} {MODE {2 V unipolar}} {NAME VCCO_707}}} \
  CONFIG.SMON_MEAS51 {{{ALARM_ENABLE 0} {ALARM_LOWER 0.00} {ALARM_UPPER 2.00} {AVERAGE_EN 0} {ENABLE 0} {MODE {2 V unipolar}} {NAME VCCO_708}}} \
  CONFIG.SMON_MEAS52 {{{ALARM_ENABLE 0} {ALARM_LOWER 0.00} {ALARM_UPPER 2.00} {AVERAGE_EN 0} {ENABLE 0} {MODE {2 V unipolar}} {NAME VCCO_709}}} \
  CONFIG.SMON_MEAS53 {{{ALARM_ENABLE 0} {ALARM_LOWER 0.00} {ALARM_UPPER 2.00} {AVERAGE_EN 0} {ENABLE 0} {MODE {2 V unipolar}} {NAME VCCO_710}}} \
  CONFIG.SMON_MEAS54 {{{ALARM_ENABLE 0} {ALARM_LOWER 0.00} {ALARM_UPPER 2.00} {AVERAGE_EN 0} {ENABLE 0} {MODE {2 V unipolar}} {NAME VCCO_711}}} \
  CONFIG.SMON_MEAS55 {{{ALARM_ENABLE 0} {ALARM_LOWER 0.00} {ALARM_UPPER 2.00} {AVERAGE_EN 0} {ENABLE 0} {MODE {2 V unipolar}} {NAME VCC_BATT}}} \
  CONFIG.SMON_MEAS56 {{{ALARM_ENABLE 0} {ALARM_LOWER 0.00} {ALARM_UPPER 2.00} {AVERAGE_EN 0} {ENABLE 0} {MODE {2 V unipolar}} {NAME VCC_PMC}}} \
  CONFIG.SMON_MEAS57 {{{ALARM_ENABLE 0} {ALARM_LOWER 0.00} {ALARM_UPPER 2.00} {AVERAGE_EN 0} {ENABLE 0} {MODE {2 V unipolar}} {NAME VCC_PSFP}}} \
  CONFIG.SMON_MEAS58 {{{ALARM_ENABLE 0} {ALARM_LOWER 0.00} {ALARM_UPPER 2.00} {AVERAGE_EN 0} {ENABLE 0} {MODE {2 V unipolar}} {NAME VCC_PSLP}}} \
  CONFIG.SMON_MEAS59 {{{ALARM_ENABLE 0} {ALARM_LOWER 0.00} {ALARM_UPPER 2.00} {AVERAGE_EN 0} {ENABLE 0} {MODE {2 V unipolar}} {NAME VCC_RAM}}} \
  CONFIG.SMON_MEAS60 {{{ALARM_ENABLE 0} {ALARM_LOWER 0.00} {ALARM_UPPER 2.00} {AVERAGE_EN 0} {ENABLE 0} {MODE {2 V unipolar}} {NAME VCC_SOC}}} \
  CONFIG.SMON_MEAS61 {{{ALARM_ENABLE 0} {ALARM_LOWER 0.00} {ALARM_UPPER 2.00} {AVERAGE_EN 0} {ENABLE 0} {MODE {2 V unipolar}} {NAME VP_VN}}} \
  CONFIG.SMON_MEAS62 {{{ALARM_ENABLE 0} {ALARM_LOWER 0.00} {ALARM_UPPER 2.00} {AVERAGE_EN 0} {ENABLE 0} {MODE None} {NAME GT_AVAUX_PKG_103}}} \
  CONFIG.SMON_MEAS63 {{{ALARM_ENABLE 0} {ALARM_LOWER 0.00} {ALARM_UPPER 2.00} {AVERAGE_EN 0} {ENABLE 0} {MODE None} {NAME GT_AVAUX_PKG_103}}} \
  CONFIG.SMON_MEAS64 {{{ALARM_ENABLE 0} {ALARM_LOWER 0.00} {ALARM_UPPER 2.00} {AVERAGE_EN 0} {ENABLE 0} {MODE None} {NAME GT_AVAUX_PKG_103}}} \
  CONFIG.SMON_MEAS65 {{{ALARM_ENABLE 0} {ALARM_LOWER 0.00} {ALARM_UPPER 2.00} {AVERAGE_EN 0} {ENABLE 0} {MODE None} {NAME GT_AVAUX_PKG_103}}} \
  CONFIG.SMON_MEAS66 {{{ALARM_ENABLE 0} {ALARM_LOWER 0.00} {ALARM_UPPER 2.00} {AVERAGE_EN 0} {ENABLE 0} {MODE None} {NAME GT_AVAUX_PKG_103}}} \
  CONFIG.SMON_MEAS67 {{{ALARM_ENABLE 0} {ALARM_LOWER 0.00} {ALARM_UPPER 2.00} {AVERAGE_EN 0} {ENABLE 0} {MODE None} {NAME GT_AVAUX_PKG_103}}} \
  CONFIG.SMON_MEAS68 {{{ALARM_ENABLE 0} {ALARM_LOWER 0.00} {ALARM_UPPER 2.00} {AVERAGE_EN 0} {ENABLE 0} {MODE None} {NAME GT_AVAUX_PKG_103}}} \
  CONFIG.SMON_MEAS69 {{{ALARM_ENABLE 0} {ALARM_LOWER 0.00} {ALARM_UPPER 2.00} {AVERAGE_EN 0} {ENABLE 0} {MODE None} {NAME GT_AVAUX_PKG_103}}} \
  CONFIG.SMON_MEAS70 {{{ALARM_ENABLE 0} {ALARM_LOWER 0.00} {ALARM_UPPER 2.00} {AVERAGE_EN 0} {ENABLE 0} {MODE None} {NAME GT_AVAUX_PKG_103}}} \
  CONFIG.SMON_MEAS71 {{{ALARM_ENABLE 0} {ALARM_LOWER 0.00} {ALARM_UPPER 2.00} {AVERAGE_EN 0} {ENABLE 0} {MODE None} {NAME GT_AVAUX_PKG_103}}} \
  CONFIG.SMON_MEAS72 {{{ALARM_ENABLE 0} {ALARM_LOWER 0.00} {ALARM_UPPER 2.00} {AVERAGE_EN 0} {ENABLE 0} {MODE None} {NAME GT_AVAUX_PKG_103}}} \
  CONFIG.SMON_MEAS73 {{{ALARM_ENABLE 0} {ALARM_LOWER 0.00} {ALARM_UPPER 2.00} {AVERAGE_EN 0} {ENABLE 0} {MODE None} {NAME GT_AVAUX_PKG_103}}} \
  CONFIG.SMON_MEAS74 {{{ALARM_ENABLE 0} {ALARM_LOWER 0.00} {ALARM_UPPER 2.00} {AVERAGE_EN 0} {ENABLE 0} {MODE None} {NAME GT_AVAUX_PKG_103}}} \
  CONFIG.SMON_MEAS75 {{{ALARM_ENABLE 0} {ALARM_LOWER 0.00} {ALARM_UPPER 2.00} {AVERAGE_EN 0} {ENABLE 0} {MODE None} {NAME GT_AVAUX_PKG_103}}} \
  CONFIG.SMON_MEAS76 {{{ALARM_ENABLE 0} {ALARM_LOWER 0.00} {ALARM_UPPER 2.00} {AVERAGE_EN 0} {ENABLE 0} {MODE None} {NAME GT_AVAUX_PKG_103}}} \
  CONFIG.SMON_MEAS77 {{{ALARM_ENABLE 0} {ALARM_LOWER 0.00} {ALARM_UPPER 2.00} {AVERAGE_EN 0} {ENABLE 0} {MODE None} {NAME GT_AVAUX_PKG_103}}} \
  CONFIG.SMON_MEAS78 {{{ALARM_ENABLE 0} {ALARM_LOWER 0.00} {ALARM_UPPER 2.00} {AVERAGE_EN 0} {ENABLE 0} {MODE None} {NAME GT_AVAUX_PKG_103}}} \
  CONFIG.SMON_MEAS79 {{{ALARM_ENABLE 0} {ALARM_LOWER 0.00} {ALARM_UPPER 2.00} {AVERAGE_EN 0} {ENABLE 0} {MODE None} {NAME GT_AVAUX_PKG_103}}} \
  CONFIG.SMON_MEAS80 {{{ALARM_ENABLE 0} {ALARM_LOWER 0.00} {ALARM_UPPER 2.00} {AVERAGE_EN 0} {ENABLE 0} {MODE None} {NAME GT_AVAUX_PKG_103}}} \
  CONFIG.SMON_MEAS81 {{{ALARM_ENABLE 0} {ALARM_LOWER 0.00} {ALARM_UPPER 2.00} {AVERAGE_EN 0} {ENABLE 0} {MODE None} {NAME GT_AVAUX_PKG_103}}} \
  CONFIG.SMON_MEAS82 {{{ALARM_ENABLE 0} {ALARM_LOWER 0.00} {ALARM_UPPER 2.00} {AVERAGE_EN 0} {ENABLE 0} {MODE None} {NAME GT_AVAUX_PKG_103}}} \
  CONFIG.SMON_MEAS83 {{{ALARM_ENABLE 0} {ALARM_LOWER 0.00} {ALARM_UPPER 2.00} {AVERAGE_EN 0} {ENABLE 0} {MODE None} {NAME GT_AVAUX_PKG_103}}} \
  CONFIG.SMON_MEAS84 {{{ALARM_ENABLE 0} {ALARM_LOWER 0.00} {ALARM_UPPER 2.00} {AVERAGE_EN 0} {ENABLE 0} {MODE None} {NAME GT_AVAUX_PKG_103}}} \
  CONFIG.SMON_MEAS85 {{{ALARM_ENABLE 0} {ALARM_LOWER 0.00} {ALARM_UPPER 2.00} {AVERAGE_EN 0} {ENABLE 0} {MODE None} {NAME GT_AVAUX_PKG_103}}} \
  CONFIG.SMON_MEAS86 {{{ALARM_ENABLE 0} {ALARM_LOWER 0.00} {ALARM_UPPER 2.00} {AVERAGE_EN 0} {ENABLE 0} {MODE None} {NAME GT_AVAUX_PKG_103}}} \
  CONFIG.SMON_MEAS87 {{{ALARM_ENABLE 0} {ALARM_LOWER 0.00} {ALARM_UPPER 2.00} {AVERAGE_EN 0} {ENABLE 0} {MODE None} {NAME GT_AVAUX_PKG_103}}} \
  CONFIG.SMON_MEAS88 {{{ALARM_ENABLE 0} {ALARM_LOWER 0.00} {ALARM_UPPER 2.00} {AVERAGE_EN 0} {ENABLE 0} {MODE None} {NAME GT_AVAUX_PKG_103}}} \
  CONFIG.SMON_MEAS89 {{{ALARM_ENABLE 0} {ALARM_LOWER 0.00} {ALARM_UPPER 2.00} {AVERAGE_EN 0} {ENABLE 0} {MODE None} {NAME GT_AVAUX_PKG_103}}} \
  CONFIG.SMON_MEAS90 {{{ALARM_ENABLE 0} {ALARM_LOWER 0.00} {ALARM_UPPER 2.00} {AVERAGE_EN 0} {ENABLE 0} {MODE None} {NAME GT_AVAUX_PKG_103}}} \
  CONFIG.SMON_MEAS91 {{{ALARM_ENABLE 0} {ALARM_LOWER 0.00} {ALARM_UPPER 2.00} {AVERAGE_EN 0} {ENABLE 0} {MODE None} {NAME GT_AVAUX_PKG_103}}} \
  CONFIG.SMON_MEAS92 {{{ALARM_ENABLE 0} {ALARM_LOWER 0.00} {ALARM_UPPER 2.00} {AVERAGE_EN 0} {ENABLE 0} {MODE None} {NAME GT_AVAUX_PKG_103}}} \
  CONFIG.SMON_MEAS93 {{{ALARM_ENABLE 0} {ALARM_LOWER 0.00} {ALARM_UPPER 2.00} {AVERAGE_EN 0} {ENABLE 0} {MODE None} {NAME GT_AVAUX_PKG_103}}} \
  CONFIG.SMON_MEAS94 {{{ALARM_ENABLE 0} {ALARM_LOWER 0.00} {ALARM_UPPER 2.00} {AVERAGE_EN 0} {ENABLE 0} {MODE None} {NAME GT_AVAUX_PKG_103}}} \
  CONFIG.SMON_MEAS95 {{{ALARM_ENABLE 0} {ALARM_LOWER 0.00} {ALARM_UPPER 2.00} {AVERAGE_EN 0} {ENABLE 0} {MODE None} {NAME GT_AVAUX_PKG_103}}} \
  CONFIG.SMON_MEAS96 {{{ALARM_ENABLE 0} {ALARM_LOWER 0.00} {ALARM_UPPER 2.00} {AVERAGE_EN 0} {ENABLE 0} {MODE None} {NAME GT_AVAUX_PKG_103}}} \
  CONFIG.SMON_MEAS97 {{{ALARM_ENABLE 0} {ALARM_LOWER 0.00} {ALARM_UPPER 2.00} {AVERAGE_EN 0} {ENABLE 0} {MODE None} {NAME GT_AVAUX_PKG_103}}} \
  CONFIG.SMON_MEAS98 {{{ALARM_ENABLE 0} {ALARM_LOWER 0.00} {ALARM_UPPER 2.00} {AVERAGE_EN 0} {ENABLE 0} {MODE None} {NAME GT_AVAUX_PKG_103}}} \
  CONFIG.SMON_MEAS99 {{{ALARM_ENABLE 0} {ALARM_LOWER 0.00} {ALARM_UPPER 2.00} {AVERAGE_EN 0} {ENABLE 0} {MODE None} {NAME GT_AVAUX_PKG_103}}} \
  CONFIG.SMON_MEAS100 {{{ALARM_ENABLE 0} {ALARM_LOWER 0.00} {ALARM_UPPER 2.00} {AVERAGE_EN 0} {ENABLE 0} {MODE None} {NAME GT_AVAUX_PKG_103}}} \
  CONFIG.SMON_MEAS101 {{{ALARM_ENABLE 0} {ALARM_LOWER 0.00} {ALARM_UPPER 2.00} {AVERAGE_EN 0} {ENABLE 0} {MODE None} {NAME GT_AVAUX_PKG_103}}} \
  CONFIG.SMON_MEAS102 {{{ALARM_ENABLE 0} {ALARM_LOWER 0.00} {ALARM_UPPER 2.00} {AVERAGE_EN 0} {ENABLE 0} {MODE None} {NAME GT_AVAUX_PKG_103}}} \
  CONFIG.SMON_MEAS103 {{{ALARM_ENABLE 0} {ALARM_LOWER 0.00} {ALARM_UPPER 2.00} {AVERAGE_EN 0} {ENABLE 0} {MODE None} {NAME GT_AVAUX_PKG_103}}} \
  CONFIG.SMON_MEAS104 {{{ALARM_ENABLE 0} {ALARM_LOWER 0.00} {ALARM_UPPER 2.00} {AVERAGE_EN 0} {ENABLE 0} {MODE None} {NAME GT_AVAUX_PKG_103}}} \
  CONFIG.SMON_MEAS105 {{{ALARM_ENABLE 0} {ALARM_LOWER 0.00} {ALARM_UPPER 2.00} {AVERAGE_EN 0} {ENABLE 0} {MODE None} {NAME GT_AVAUX_PKG_103}}} \
  CONFIG.SMON_MEAS106 {{{ALARM_ENABLE 0} {ALARM_LOWER 0.00} {ALARM_UPPER 2.00} {AVERAGE_EN 0} {ENABLE 0} {MODE None} {NAME GT_AVAUX_PKG_103}}} \
  CONFIG.SMON_MEAS107 {{{ALARM_ENABLE 0} {ALARM_LOWER 0.00} {ALARM_UPPER 2.00} {AVERAGE_EN 0} {ENABLE 0} {MODE None} {NAME GT_AVAUX_PKG_103}}} \
  CONFIG.SMON_MEAS108 {{{ALARM_ENABLE 0} {ALARM_LOWER 0.00} {ALARM_UPPER 2.00} {AVERAGE_EN 0} {ENABLE 0} {MODE None} {NAME GT_AVAUX_PKG_103}}} \
  CONFIG.SMON_MEAS109 {{{ALARM_ENABLE 0} {ALARM_LOWER 0.00} {ALARM_UPPER 2.00} {AVERAGE_EN 0} {ENABLE 0} {MODE None} {NAME GT_AVAUX_PKG_103}}} \
  CONFIG.SMON_MEAS110 {{{ALARM_ENABLE 0} {ALARM_LOWER 0.00} {ALARM_UPPER 2.00} {AVERAGE_EN 0} {ENABLE 0} {MODE None} {NAME GT_AVAUX_PKG_103}}} \
  CONFIG.SMON_MEAS111 {{{ALARM_ENABLE 0} {ALARM_LOWER 0.00} {ALARM_UPPER 2.00} {AVERAGE_EN 0} {ENABLE 0} {MODE None} {NAME GT_AVAUX_PKG_103}}} \
  CONFIG.SMON_MEAS112 {{{ALARM_ENABLE 0} {ALARM_LOWER 0.00} {ALARM_UPPER 2.00} {AVERAGE_EN 0} {ENABLE 0} {MODE None} {NAME GT_AVAUX_PKG_103}}} \
  CONFIG.SMON_MEAS113 {{{ALARM_ENABLE 0} {ALARM_LOWER 0.00} {ALARM_UPPER 2.00} {AVERAGE_EN 0} {ENABLE 0} {MODE None} {NAME GT_AVAUX_PKG_103}}} \
  CONFIG.SMON_MEAS114 {{{ALARM_ENABLE 0} {ALARM_LOWER 0.00} {ALARM_UPPER 2.00} {AVERAGE_EN 0} {ENABLE 0} {MODE None} {NAME GT_AVAUX_PKG_103}}} \
  CONFIG.SMON_MEAS115 {{{ALARM_ENABLE 0} {ALARM_LOWER 0.00} {ALARM_UPPER 2.00} {AVERAGE_EN 0} {ENABLE 0} {MODE None} {NAME GT_AVAUX_PKG_103}}} \
  CONFIG.SMON_MEAS116 {{{ALARM_ENABLE 0} {ALARM_LOWER 0.00} {ALARM_UPPER 2.00} {AVERAGE_EN 0} {ENABLE 0} {MODE None} {NAME GT_AVAUX_PKG_103}}} \
  CONFIG.SMON_MEAS117 {{{ALARM_ENABLE 0} {ALARM_LOWER 0.00} {ALARM_UPPER 2.00} {AVERAGE_EN 0} {ENABLE 0} {MODE None} {NAME GT_AVAUX_PKG_103}}} \
  CONFIG.SMON_MEAS118 {{{ALARM_ENABLE 0} {ALARM_LOWER 0.00} {ALARM_UPPER 2.00} {AVERAGE_EN 0} {ENABLE 0} {MODE None} {NAME GT_AVAUX_PKG_103}}} \
  CONFIG.SMON_MEAS119 {{{ALARM_ENABLE 0} {ALARM_LOWER 0.00} {ALARM_UPPER 2.00} {AVERAGE_EN 0} {ENABLE 0} {MODE None} {NAME GT_AVAUX_PKG_103}}} \
  CONFIG.SMON_MEAS120 {{{ALARM_ENABLE 0} {ALARM_LOWER 0.00} {ALARM_UPPER 2.00} {AVERAGE_EN 0} {ENABLE 0} {MODE None} {NAME GT_AVAUX_PKG_103}}} \
  CONFIG.SMON_MEAS121 {{{ALARM_ENABLE 0} {ALARM_LOWER 0.00} {ALARM_UPPER 2.00} {AVERAGE_EN 0} {ENABLE 0} {MODE None} {NAME GT_AVAUX_PKG_103}}} \
  CONFIG.SMON_MEAS122 {{{ALARM_ENABLE 0} {ALARM_LOWER 0.00} {ALARM_UPPER 2.00} {AVERAGE_EN 0} {ENABLE 0} {MODE None} {NAME GT_AVAUX_PKG_103}}} \
  CONFIG.SMON_MEAS123 {{{ALARM_ENABLE 0} {ALARM_LOWER 0.00} {ALARM_UPPER 2.00} {AVERAGE_EN 0} {ENABLE 0} {MODE None} {NAME GT_AVAUX_PKG_103}}} \
  CONFIG.SMON_MEAS124 {{{ALARM_ENABLE 0} {ALARM_LOWER 0.00} {ALARM_UPPER 2.00} {AVERAGE_EN 0} {ENABLE 0} {MODE None} {NAME GT_AVAUX_PKG_103}}} \
  CONFIG.SMON_MEAS125 {{{ALARM_ENABLE 0} {ALARM_LOWER 0.00} {ALARM_UPPER 2.00} {AVERAGE_EN 0} {ENABLE 0} {MODE None} {NAME GT_AVAUX_PKG_103}}} \
  CONFIG.SMON_MEAS126 {{{ALARM_ENABLE 0} {ALARM_LOWER 0.00} {ALARM_UPPER 2.00} {AVERAGE_EN 0} {ENABLE 0} {MODE None} {NAME GT_AVAUX_PKG_103}}} \
  CONFIG.SMON_MEAS127 {{{ALARM_ENABLE 0} {ALARM_LOWER 0.00} {ALARM_UPPER 2.00} {AVERAGE_EN 0} {ENABLE 0} {MODE None} {NAME GT_AVAUX_PKG_103}}} \
  CONFIG.SMON_MEAS128 {{{ALARM_ENABLE 0} {ALARM_LOWER 0.00} {ALARM_UPPER 2.00} {AVERAGE_EN 0} {ENABLE 0} {MODE None} {NAME GT_AVAUX_PKG_103}}} \
  CONFIG.SMON_MEAS129 {{{ALARM_ENABLE 0} {ALARM_LOWER 0.00} {ALARM_UPPER 2.00} {AVERAGE_EN 0} {ENABLE 0} {MODE None} {NAME GT_AVAUX_PKG_103}}} \
  CONFIG.SMON_MEAS130 {{{ALARM_ENABLE 0} {ALARM_LOWER 0.00} {ALARM_UPPER 2.00} {AVERAGE_EN 0} {ENABLE 0} {MODE None} {NAME GT_AVAUX_PKG_103}}} \
  CONFIG.SMON_MEAS131 {{{ALARM_ENABLE 0} {ALARM_LOWER 0.00} {ALARM_UPPER 2.00} {AVERAGE_EN 0} {ENABLE 0} {MODE None} {NAME GT_AVAUX_PKG_103}}} \
  CONFIG.SMON_MEAS132 {{{ALARM_ENABLE 0} {ALARM_LOWER 0.00} {ALARM_UPPER 2.00} {AVERAGE_EN 0} {ENABLE 0} {MODE None} {NAME GT_AVAUX_PKG_103}}} \
  CONFIG.SMON_MEAS133 {{{ALARM_ENABLE 0} {ALARM_LOWER 0.00} {ALARM_UPPER 2.00} {AVERAGE_EN 0} {ENABLE 0} {MODE None} {NAME GT_AVAUX_PKG_103}}} \
  CONFIG.SMON_MEAS134 {{{ALARM_ENABLE 0} {ALARM_LOWER 0.00} {ALARM_UPPER 2.00} {AVERAGE_EN 0} {ENABLE 0} {MODE None} {NAME GT_AVAUX_PKG_103}}} \
  CONFIG.SMON_MEAS135 {{{ALARM_ENABLE 0} {ALARM_LOWER 0.00} {ALARM_UPPER 2.00} {AVERAGE_EN 0} {ENABLE 0} {MODE None} {NAME GT_AVAUX_PKG_103}}} \
  CONFIG.SMON_MEAS136 {{{ALARM_ENABLE 0} {ALARM_LOWER 0.00} {ALARM_UPPER 2.00} {AVERAGE_EN 0} {ENABLE 0} {MODE None} {NAME GT_AVAUX_PKG_103}}} \
  CONFIG.SMON_MEAS137 {{{ALARM_ENABLE 0} {ALARM_LOWER 0.00} {ALARM_UPPER 2.00} {AVERAGE_EN 0} {ENABLE 0} {MODE None} {NAME GT_AVAUX_PKG_103}}} \
  CONFIG.SMON_MEAS138 {{{ALARM_ENABLE 0} {ALARM_LOWER 0.00} {ALARM_UPPER 2.00} {AVERAGE_EN 0} {ENABLE 0} {MODE None} {NAME GT_AVAUX_PKG_103}}} \
  CONFIG.SMON_MEAS139 {{{ALARM_ENABLE 0} {ALARM_LOWER 0.00} {ALARM_UPPER 2.00} {AVERAGE_EN 0} {ENABLE 0} {MODE None} {NAME GT_AVAUX_PKG_103}}} \
  CONFIG.SMON_MEAS140 {{{ALARM_ENABLE 0} {ALARM_LOWER 0.00} {ALARM_UPPER 2.00} {AVERAGE_EN 0} {ENABLE 0} {MODE None} {NAME GT_AVAUX_PKG_103}}} \
  CONFIG.SMON_MEAS141 {{{ALARM_ENABLE 0} {ALARM_LOWER 0.00} {ALARM_UPPER 2.00} {AVERAGE_EN 0} {ENABLE 0} {MODE None} {NAME GT_AVAUX_PKG_103}}} \
  CONFIG.SMON_MEAS142 {{{ALARM_ENABLE 0} {ALARM_LOWER 0.00} {ALARM_UPPER 2.00} {AVERAGE_EN 0} {ENABLE 0} {MODE None} {NAME GT_AVAUX_PKG_103}}} \
  CONFIG.SMON_MEAS143 {{{ALARM_ENABLE 0} {ALARM_LOWER 0.00} {ALARM_UPPER 2.00} {AVERAGE_EN 0} {ENABLE 0} {MODE None} {NAME GT_AVAUX_PKG_103}}} \
  CONFIG.SMON_MEAS144 {{{ALARM_ENABLE 0} {ALARM_LOWER 0.00} {ALARM_UPPER 2.00} {AVERAGE_EN 0} {ENABLE 0} {MODE None} {NAME GT_AVAUX_PKG_103}}} \
  CONFIG.SMON_MEAS145 {{{ALARM_ENABLE 0} {ALARM_LOWER 0.00} {ALARM_UPPER 2.00} {AVERAGE_EN 0} {ENABLE 0} {MODE None} {NAME GT_AVAUX_PKG_103}}} \
  CONFIG.SMON_MEAS146 {{{ALARM_ENABLE 0} {ALARM_LOWER 0.00} {ALARM_UPPER 2.00} {AVERAGE_EN 0} {ENABLE 0} {MODE None} {NAME GT_AVAUX_PKG_103}}} \
  CONFIG.SMON_MEAS147 {{{ALARM_ENABLE 0} {ALARM_LOWER 0.00} {ALARM_UPPER 2.00} {AVERAGE_EN 0} {ENABLE 0} {MODE None} {NAME GT_AVAUX_PKG_103}}} \
  CONFIG.SMON_MEAS148 {{{ALARM_ENABLE 0} {ALARM_LOWER 0.00} {ALARM_UPPER 2.00} {AVERAGE_EN 0} {ENABLE 0} {MODE None} {NAME GT_AVAUX_PKG_103}}} \
  CONFIG.SMON_MEAS149 {{{ALARM_ENABLE 0} {ALARM_LOWER 0.00} {ALARM_UPPER 2.00} {AVERAGE_EN 0} {ENABLE 0} {MODE None} {NAME GT_AVAUX_PKG_103}}} \
  CONFIG.SMON_MEAS150 {{{ALARM_ENABLE 0} {ALARM_LOWER 0.00} {ALARM_UPPER 2.00} {AVERAGE_EN 0} {ENABLE 0} {MODE None} {NAME GT_AVAUX_PKG_103}}} \
  CONFIG.SMON_MEAS151 {{{ALARM_ENABLE 0} {ALARM_LOWER 0.00} {ALARM_UPPER 2.00} {AVERAGE_EN 0} {ENABLE 0} {MODE None} {NAME GT_AVAUX_PKG_103}}} \
  CONFIG.SMON_MEAS152 {{{ALARM_ENABLE 0} {ALARM_LOWER 0.00} {ALARM_UPPER 2.00} {AVERAGE_EN 0} {ENABLE 0} {MODE None} {NAME GT_AVAUX_PKG_103}}} \
  CONFIG.SMON_MEAS153 {{{ALARM_ENABLE 0} {ALARM_LOWER 0.00} {ALARM_UPPER 2.00} {AVERAGE_EN 0} {ENABLE 0} {MODE None} {NAME GT_AVAUX_PKG_103}}} \
  CONFIG.SMON_MEAS154 {{{ALARM_ENABLE 0} {ALARM_LOWER 0.00} {ALARM_UPPER 2.00} {AVERAGE_EN 0} {ENABLE 0} {MODE None} {NAME GT_AVAUX_PKG_103}}} \
  CONFIG.SMON_MEAS155 {{{ALARM_ENABLE 0} {ALARM_LOWER 0.00} {ALARM_UPPER 2.00} {AVERAGE_EN 0} {ENABLE 0} {MODE None} {NAME GT_AVAUX_PKG_103}}} \
  CONFIG.SMON_MEAS156 {{{ALARM_ENABLE 0} {ALARM_LOWER 0.00} {ALARM_UPPER 2.00} {AVERAGE_EN 0} {ENABLE 0} {MODE None} {NAME GT_AVAUX_PKG_103}}} \
  CONFIG.SMON_MEAS157 {{{ALARM_ENABLE 0} {ALARM_LOWER 0.00} {ALARM_UPPER 2.00} {AVERAGE_EN 0} {ENABLE 0} {MODE None} {NAME GT_AVAUX_PKG_103}}} \
  CONFIG.SMON_MEAS158 {{{ALARM_ENABLE 0} {ALARM_LOWER 0.00} {ALARM_UPPER 2.00} {AVERAGE_EN 0} {ENABLE 0} {MODE None} {NAME GT_AVAUX_PKG_103}}} \
  CONFIG.SMON_MEAS159 {{{ALARM_ENABLE 0} {ALARM_LOWER 0.00} {ALARM_UPPER 2.00} {AVERAGE_EN 0} {ENABLE 0} {MODE None} {NAME GT_AVAUX_PKG_103}}} \
  CONFIG.SMON_MEAS160 {{{ALARM_ENABLE 0} {ALARM_LOWER 0.00} {ALARM_UPPER 2.00} {AVERAGE_EN 0} {ENABLE 0} {MODE None} {NAME GT_AVAUX_PKG_103}}} \
  CONFIG.SMON_MEAS161 {{{ALARM_ENABLE 0} {ALARM_LOWER 0.00} {ALARM_UPPER 2.00} {AVERAGE_EN 0} {ENABLE 0} {MODE None} {NAME GT_AVAUX_PKG_103}}} \
  CONFIG.SMON_MEAS162 {{{ALARM_ENABLE 0} {ALARM_LOWER 0.00} {ALARM_UPPER 2.00} {AVERAGE_EN 0} {ENABLE 0} {MODE None} {NAME GT_AVAUX_PKG_103}}} \
  CONFIG.SMON_MEAS163 {{{ALARM_ENABLE 0} {ALARM_LOWER 0.00} {ALARM_UPPER 2.00} {AVERAGE_EN 0} {ENABLE 0} {MODE None} {NAME GT_AVAUX_PKG_103}}} \
  CONFIG.SMON_MEAS164 {{{ALARM_ENABLE 0} {ALARM_LOWER 0.00} {ALARM_UPPER 2.00} {AVERAGE_EN 0} {ENABLE 0} {MODE None} {NAME GT_AVAUX_PKG_103}}} \
  CONFIG.SMON_MEAS165 {{{ALARM_ENABLE 0} {ALARM_LOWER 0.00} {ALARM_UPPER 2.00} {AVERAGE_EN 0} {ENABLE 0} {MODE None} {NAME GT_AVAUX_PKG_103}}} \
  CONFIG.SMON_MEAS166 {{{ALARM_ENABLE 0} {ALARM_LOWER 0.00} {ALARM_UPPER 2.00} {AVERAGE_EN 0} {ENABLE 0} {MODE None} {NAME GT_AVAUX_PKG_103}}} \
  CONFIG.SMON_MEAS167 {{{ALARM_ENABLE 0} {ALARM_LOWER 0.00} {ALARM_UPPER 2.00} {AVERAGE_EN 0} {ENABLE 0} {MODE None} {NAME GT_AVAUX_PKG_103}}} \
  CONFIG.SMON_MEAS168 {{{ALARM_ENABLE 0} {ALARM_LOWER 0.00} {ALARM_UPPER 2.00} {AVERAGE_EN 0} {ENABLE 0} {MODE None} {NAME GT_AVAUX_PKG_103}}} \
  CONFIG.SMON_MEAS169 {{{ALARM_ENABLE 0} {ALARM_LOWER 0.00} {ALARM_UPPER 2.00} {AVERAGE_EN 0} {ENABLE 0} {MODE None} {NAME GT_AVAUX_PKG_103}}} \
  CONFIG.SMON_MEAS170 {{{ALARM_ENABLE 0} {ALARM_LOWER 0.00} {ALARM_UPPER 2.00} {AVERAGE_EN 0} {ENABLE 0} {MODE None} {NAME GT_AVAUX_PKG_103}}} \
  CONFIG.SMON_MEAS171 {{{ALARM_ENABLE 0} {ALARM_LOWER 0.00} {ALARM_UPPER 2.00} {AVERAGE_EN 0} {ENABLE 0} {MODE None} {NAME GT_AVAUX_PKG_103}}} \
  CONFIG.SMON_MEAS172 {{{ALARM_ENABLE 0} {ALARM_LOWER 0.00} {ALARM_UPPER 2.00} {AVERAGE_EN 0} {ENABLE 0} {MODE None} {NAME GT_AVAUX_PKG_103}}} \
  CONFIG.SMON_MEAS173 {{{ALARM_ENABLE 0} {ALARM_LOWER 0.00} {ALARM_UPPER 2.00} {AVERAGE_EN 0} {ENABLE 0} {MODE None} {NAME GT_AVAUX_PKG_103}}} \
  CONFIG.SMON_MEAS174 {{{ALARM_ENABLE 0} {ALARM_LOWER 0.00} {ALARM_UPPER 2.00} {AVERAGE_EN 0} {ENABLE 0} {MODE None} {NAME GT_AVAUX_PKG_103}}} \
  CONFIG.SMON_MEAS175 {{{ALARM_ENABLE 0} {ALARM_LOWER 0.00} {ALARM_UPPER 2.00} {AVERAGE_EN 0} {ENABLE 0} {MODE None} {NAME GT_AVAUX_PKG_103}}} \
  CONFIG.SMON_OT {{{THRESHOLD_LOWER -55} {THRESHOLD_UPPER 125}}} \
  CONFIG.SMON_USER_TEMP {{{THRESHOLD_LOWER 0} {THRESHOLD_UPPER 125} {USER_ALARM_TYPE window}}} \
  CONFIG.SMON_VAUX_CH0 {{{ALARM_ENABLE 0} {ALARM_LOWER 0} {ALARM_UPPER 0} {AVERAGE_EN 0} {ENABLE 0} {IO_N PMC_MIO1_500} {IO_P PMC_MIO0_500} {MODE {1 V unipolar}} {NAME VAUX_CH0}}} \
  CONFIG.SMON_VAUX_CH1 {{{ALARM_ENABLE 0} {ALARM_LOWER 0} {ALARM_UPPER 0} {AVERAGE_EN 0} {ENABLE 0} {IO_N PMC_MIO1_500} {IO_P PMC_MIO0_500} {MODE {1 V unipolar}} {NAME VAUX_CH1}}} \
  CONFIG.SMON_VAUX_CH2 {{{ALARM_ENABLE 0} {ALARM_LOWER 0} {ALARM_UPPER 0} {AVERAGE_EN 0} {ENABLE 0} {IO_N PMC_MIO1_500} {IO_P PMC_MIO0_500} {MODE {1 V unipolar}} {NAME VAUX_CH2}}} \
  CONFIG.SMON_VAUX_CH3 {{{ALARM_ENABLE 0} {ALARM_LOWER 0} {ALARM_UPPER 0} {AVERAGE_EN 0} {ENABLE 0} {IO_N PMC_MIO1_500} {IO_P PMC_MIO0_500} {MODE {1 V unipolar}} {NAME VAUX_CH3}}} \
  CONFIG.SMON_VAUX_CH4 {{{ALARM_ENABLE 0} {ALARM_LOWER 0} {ALARM_UPPER 0} {AVERAGE_EN 0} {ENABLE 0} {IO_N PMC_MIO1_500} {IO_P PMC_MIO0_500} {MODE {1 V unipolar}} {NAME VAUX_CH4}}} \
  CONFIG.SMON_VAUX_CH5 {{{ALARM_ENABLE 0} {ALARM_LOWER 0} {ALARM_UPPER 0} {AVERAGE_EN 0} {ENABLE 0} {IO_N PMC_MIO1_500} {IO_P PMC_MIO0_500} {MODE {1 V unipolar}} {NAME VAUX_CH5}}} \
  CONFIG.SMON_VAUX_CH6 {{{ALARM_ENABLE 0} {ALARM_LOWER 0} {ALARM_UPPER 0} {AVERAGE_EN 0} {ENABLE 0} {IO_N PMC_MIO1_500} {IO_P PMC_MIO0_500} {MODE {1 V unipolar}} {NAME VAUX_CH6}}} \
  CONFIG.SMON_VAUX_CH7 {{{ALARM_ENABLE 0} {ALARM_LOWER 0} {ALARM_UPPER 0} {AVERAGE_EN 0} {ENABLE 0} {IO_N PMC_MIO1_500} {IO_P PMC_MIO0_500} {MODE {1 V unipolar}} {NAME VAUX_CH7}}} \
  CONFIG.SMON_VAUX_CH8 {{{ALARM_ENABLE 0} {ALARM_LOWER 0} {ALARM_UPPER 0} {AVERAGE_EN 0} {ENABLE 0} {IO_N PMC_MIO1_500} {IO_P PMC_MIO0_500} {MODE {1 V unipolar}} {NAME VAUX_CH8}}} \
  CONFIG.SMON_VAUX_CH9 {{{ALARM_ENABLE 0} {ALARM_LOWER 0} {ALARM_UPPER 0} {AVERAGE_EN 0} {ENABLE 0} {IO_N PMC_MIO1_500} {IO_P PMC_MIO0_500} {MODE {1 V unipolar}} {NAME VAUX_CH9}}} \
  CONFIG.SMON_VAUX_CH10 {{{ALARM_ENABLE 0} {ALARM_LOWER 0} {ALARM_UPPER 0} {AVERAGE_EN 0} {ENABLE 0} {IO_N PMC_MIO1_500} {IO_P PMC_MIO0_500} {MODE {1 V unipolar}} {NAME VAUX_CH10}}} \
  CONFIG.SMON_VAUX_CH11 {{{ALARM_ENABLE 0} {ALARM_LOWER 0} {ALARM_UPPER 0} {AVERAGE_EN 0} {ENABLE 0} {IO_N PMC_MIO1_500} {IO_P PMC_MIO0_500} {MODE {1 V unipolar}} {NAME VAUX_CH11}}} \
  CONFIG.SMON_VAUX_CH12 {{{ALARM_ENABLE 0} {ALARM_LOWER 0} {ALARM_UPPER 0} {AVERAGE_EN 0} {ENABLE 0} {IO_N PMC_MIO1_500} {IO_P PMC_MIO0_500} {MODE {1 V unipolar}} {NAME VAUX_CH12}}} \
  CONFIG.SMON_VAUX_CH13 {{{ALARM_ENABLE 0} {ALARM_LOWER 0} {ALARM_UPPER 0} {AVERAGE_EN 0} {ENABLE 0} {IO_N PMC_MIO1_500} {IO_P PMC_MIO0_500} {MODE {1 V unipolar}} {NAME VAUX_CH13}}} \
  CONFIG.SMON_VAUX_CH14 {{{ALARM_ENABLE 0} {ALARM_LOWER 0} {ALARM_UPPER 0} {AVERAGE_EN 0} {ENABLE 0} {IO_N PMC_MIO1_500} {IO_P PMC_MIO0_500} {MODE {1 V unipolar}} {NAME VAUX_CH14}}} \
  CONFIG.SMON_VAUX_CH15 {{{ALARM_ENABLE 0} {ALARM_LOWER 0} {ALARM_UPPER 0} {AVERAGE_EN 0} {ENABLE 0} {IO_N PMC_MIO1_500} {IO_P PMC_MIO0_500} {MODE {1 V unipolar}} {NAME VAUX_CH15}}} \
  CONFIG.preset None \
] [get_bd_cells pspmc_0]
